# Altium schematic sheet MotorDrv.SchDoc
size A4
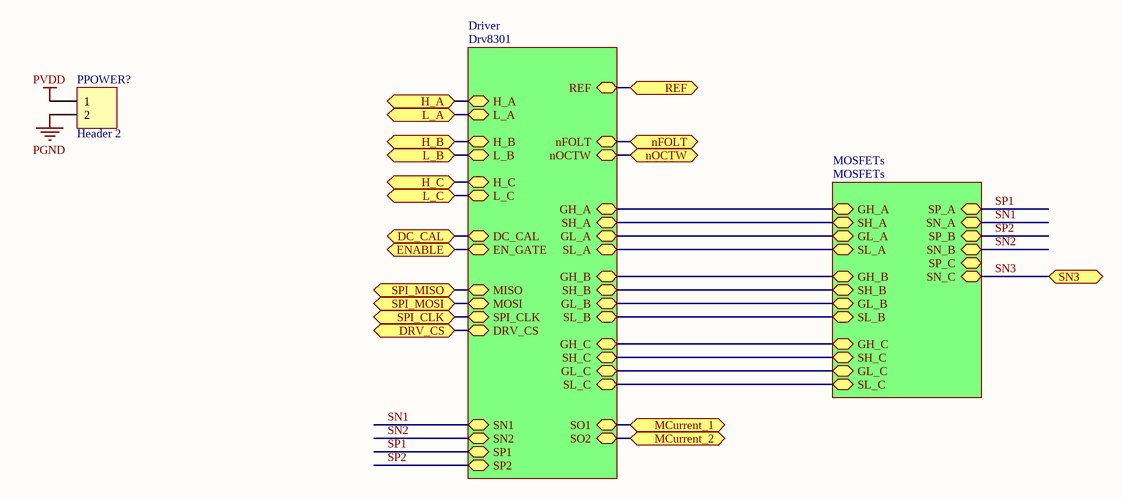
[diagram p0: MotorDrv.SchDoc]

## Parts
PPOWER?  Header 2  [WJ370-02-75]

## Sub-sheets
Driver = Drv8301: L_B, REF, SH_B, MISO, GH_B, nOCTW, H_A, EN_GATE, GL_C, GL_A, H_B, SO1, GH_C, SO2, nFOLT, GL_B, SH_A, DC_CAL, L_A, GH_A, SPI_CLK, SL_A, L_C, H_C, SL_C, SH_C, MOSI, SL_B, DRV_CS, SN1, SN2, SP2, SP1
MOSFETs = MOSFETs: SP_B, SP_C, SH_B, SL_B, SN_C, GL_B, SN_B, GH_B, SP_A, GL_A, SN_A, SL_A, GH_A, GL_C, SH_A, SL_C, SH_C, GH_C

## Ports
DC_CAL, DRV_CS, ENABLE, H_A, H_B, H_C, L_A, L_B, L_C, MCurrent_1, MCurrent_2, nFOLT, nOCTW, REF, SN3, SPI_CLK, SPI_MISO, SPI_MOSI

## Nets
PGND: PPOWER?.2
PVDD: PPOWER?.1
DC_CAL: port DC_CAL, sheet Driver/DC_CAL
DRV_CS: port DRV_CS, sheet Driver/DRV_CS
ENABLE: port ENABLE, sheet Driver/EN_GATE
H_A: port H_A, sheet Driver/H_A
H_B: port H_B, sheet Driver/H_B
H_C: port H_C, sheet Driver/H_C
L_A: port L_A, sheet Driver/L_A
L_B: port L_B, sheet Driver/L_B
L_C: port L_C, sheet Driver/L_C
MCurrent_1: port MCurrent_1, sheet Driver/SO1
MCurrent_2: port MCurrent_2, sheet Driver/SO2
nFOLT: port nFOLT, sheet Driver/nFOLT
nOCTW: port nOCTW, sheet Driver/nOCTW
REF: port REF, sheet Driver/REF
SN1: sheet Driver/SN1, sheet MOSFETs/SN_A
SN2: sheet Driver/SN2, sheet MOSFETs/SN_B
SN3: port SN3, sheet MOSFETs/SN_C
SP1: sheet Driver/SP1, sheet MOSFETs/SP_A
SP2: sheet Driver/SP2, sheet MOSFETs/SP_B
SPI_CLK: port SPI_CLK, sheet Driver/SPI_CLK
SPI_MISO: port SPI_MISO, sheet Driver/MISO
SPI_MOSI: port SPI_MOSI, sheet Driver/MOSI
(unnamed): sheet Driver/SH_B, sheet MOSFETs/SH_B
(unnamed): sheet Driver/GH_B, sheet MOSFETs/GH_B
(unnamed): sheet Driver/GL_C, sheet MOSFETs/GL_C
(unnamed): sheet Driver/GL_A, sheet MOSFETs/GL_A
(unnamed): sheet Driver/GH_C, sheet MOSFETs/GH_C
(unnamed): sheet Driver/GL_B, sheet MOSFETs/GL_B
(unnamed): sheet Driver/SH_A, sheet MOSFETs/SH_A
(unnamed): sheet Driver/GH_A, sheet MOSFETs/GH_A
(unnamed): sheet Driver/SL_A, sheet MOSFETs/SL_A
(unnamed): sheet Driver/SL_C, sheet MOSFETs/SL_C
(unnamed): sheet Driver/SH_C, sheet MOSFETs/SH_C
(unnamed): sheet Driver/SL_B, sheet MOSFETs/SL_B

## Library data of the parts
PPOWER? = Header 2: Header, 2-Pin; LatestRevisionDate: 17-Jul-2002; LatestRevisionNote: Re-released for DXP Platform.; Publisher: Altium Limited